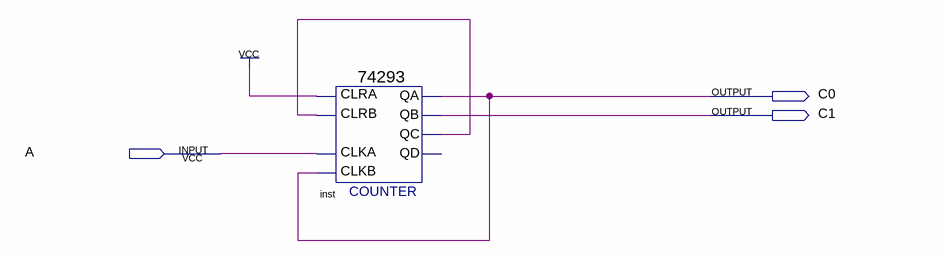
[diagram p0: schematic sheet]
// Quartus schematic Figura2.bdf as structural Verilog: 1 symbols, 3 pins
module Figura2 (
  input  A,
  output C0,
  output C1
);

  wire inst_qc;

  \74293  inst (.CLKB(C0), .CLRB(inst_qc), .CLRA(1'b1), .CLKA(A), .QB(C1), .QC(inst_qc), .QA(C0));  // open: QD
endmodule
